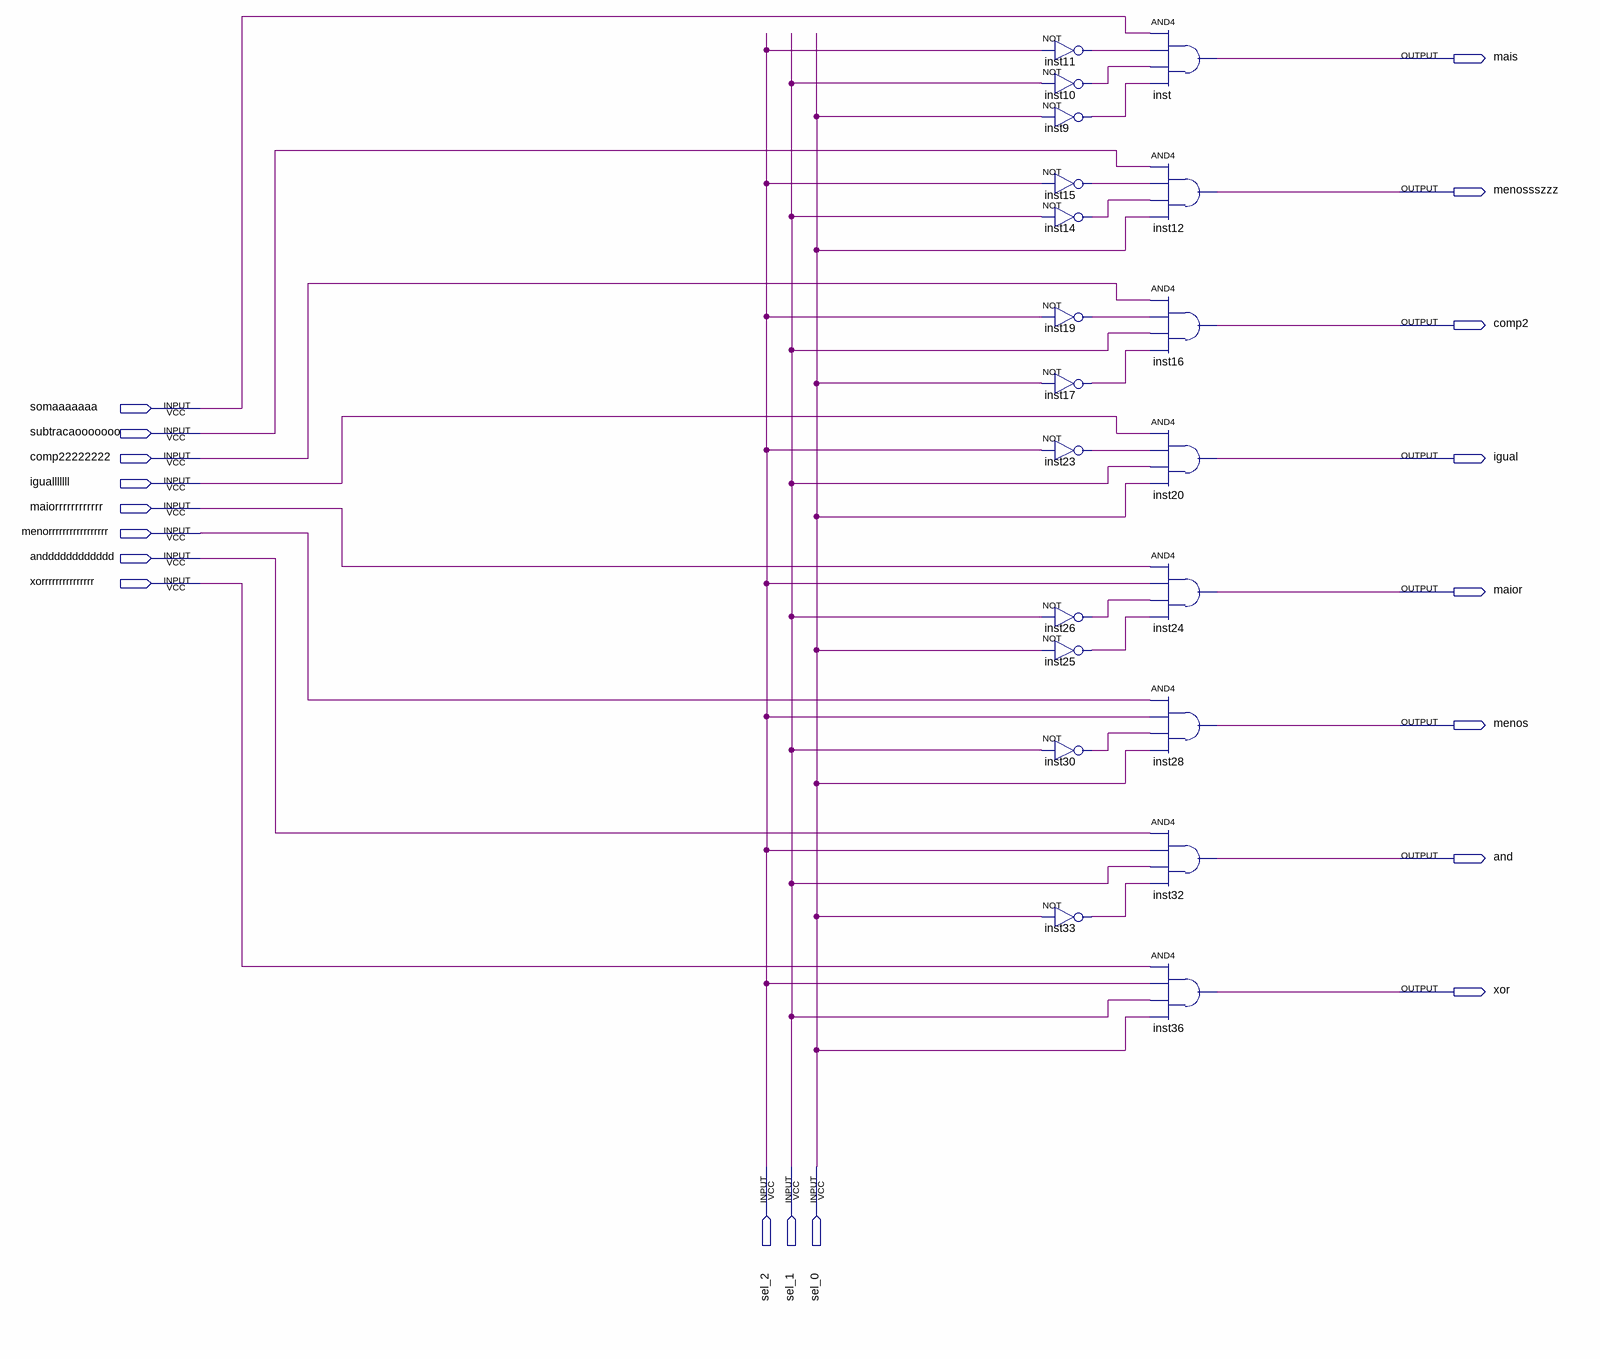
[diagram p0: schematic sheet]
// Quartus schematic mux2.bdf as structural Verilog: 20 symbols, 19 pins
module mux2 (
  input  somaaaaaaa,
  input  subtracaooooooo,
  input  comp22222222,
  input  igualllllll,
  input  maiorrrrrrrrrrrr,
  input  menorrrrrrrrrrrrrrrrr,
  input  andddddddddddd,
  input  xorrrrrrrrrrrrrrr,
  input  sel_2,
  input  sel_1,
  input  sel_0,
  output mais,
  output menossszzz,
  output comp2,
  output igual,
  output maior,
  output menos,
  output \and ,
  output \xor 
);

  wire inst9_out, inst10_out, inst11_out, inst14_out, inst15_out, inst17_out, inst19_out, inst23_out,
       inst25_out, inst26_out, inst30_out, inst33_out;

  not inst11 (inst11_out, sel_2);
  not inst10 (inst10_out, sel_1);
  not inst9 (inst9_out, sel_0);
  not inst15 (inst15_out, sel_2);
  not inst14 (inst14_out, sel_1);
  not inst19 (inst19_out, sel_2);
  not inst17 (inst17_out, sel_0);
  not inst23 (inst23_out, sel_2);
  not inst26 (inst26_out, sel_1);
  not inst25 (inst25_out, sel_0);
  not inst30 (inst30_out, sel_1);
  not inst33 (inst33_out, sel_0);
  and inst (mais, somaaaaaaa, inst11_out, inst10_out, inst9_out);
  and inst12 (menossszzz, subtracaooooooo, inst15_out, inst14_out, sel_0);
  and inst16 (comp2, comp22222222, inst19_out, sel_1, inst17_out);
  and inst20 (igual, igualllllll, inst23_out, sel_1, sel_0);
  and inst24 (maior, maiorrrrrrrrrrrr, sel_2, inst26_out, inst25_out);
  and inst28 (menos, menorrrrrrrrrrrrrrrrr, sel_2, inst30_out, sel_0);
  and inst32 (\and , andddddddddddd, sel_2, sel_1, inst33_out);
  and inst36 (\xor , xorrrrrrrrrrrrrrr, sel_2, sel_1, sel_0);
endmodule
